# EasyEDA schematic circuit.json
TITLE: IH Temp Monitor; REV: 1.0; Date: 2018-09-06; Sheet: 1/1; Drawn By: Adrian Ritchie
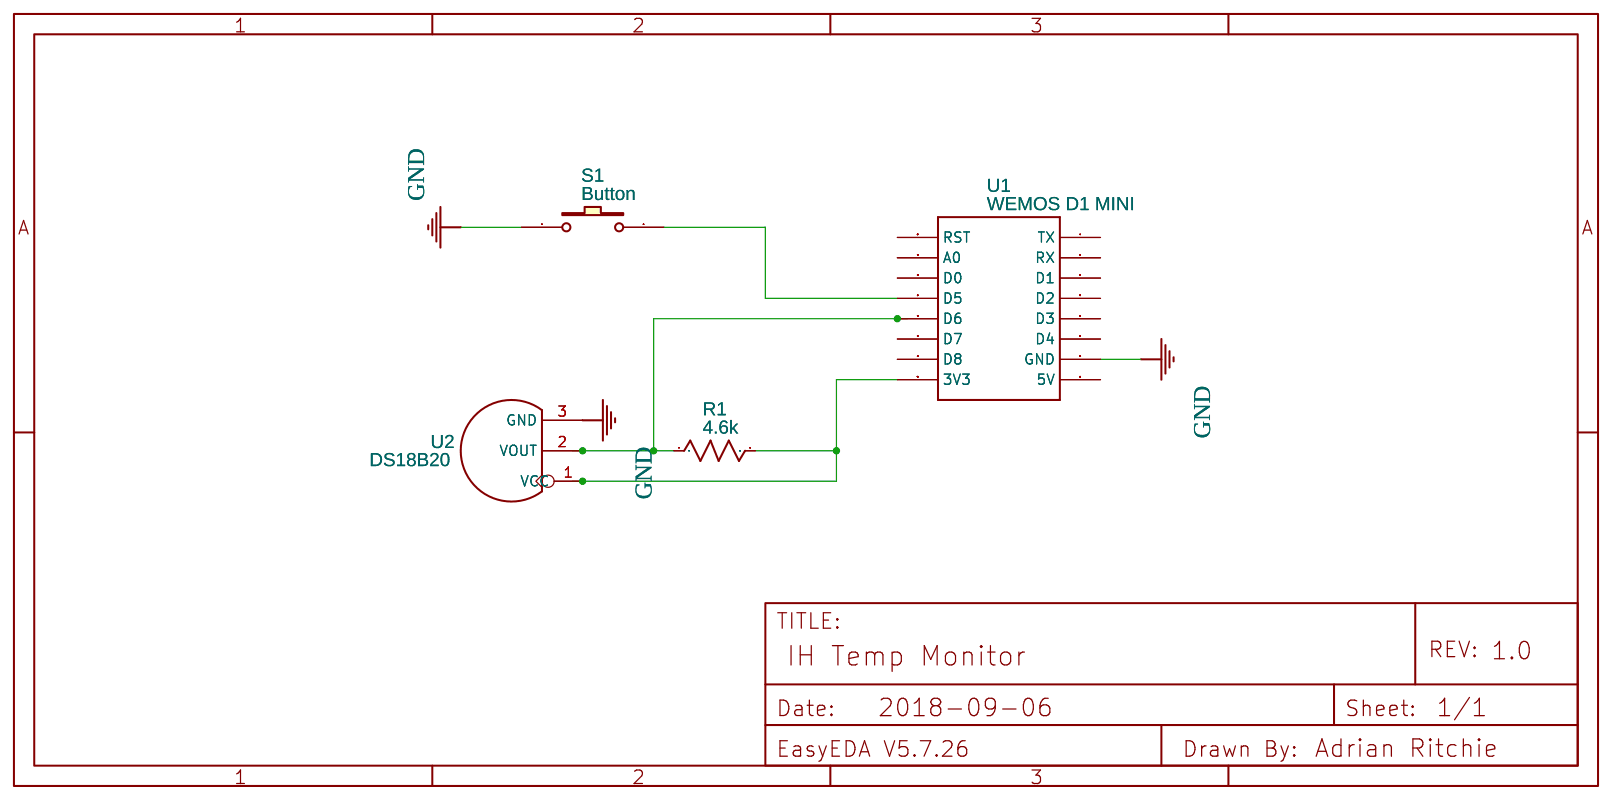
[diagram p0: schematic sheet]

## Parts
R1  4.6k  [AXIAL-0.3]
S1  Button  [PUSH BUTTON 6MM]
U1  WEMOS D1 MINI  [MY WEMOS D1 MINI V2]
U2  DS18B20  [TO-92 AMMO]

## Library data of the parts
R1 = Res_AXIAL-0.3(1/8W)_US: Manufacturer Part: ?
S1 = -: sourceId: K60iAuM3l; Manufacturer Part: ?
U1 = -: sourceId: YemgaslDx; Manufacturer Part: ?
U2 = -: Dallas 1-wire Temp Sensor; Supplier Part: 314010014; Supplier: SeeedStudio

## Nets
GND: S1.1 U1.GND U2.3(GND)
Net-(R1-1): R1.1 U1.D6 U2.2(VOUT)
Net-(R1-2): R1.2 U1.3V3 U2.1(VCC)
Net-(S1-2): S1.2 U1.D5

Not connected (* = marked no-connect by the designer): U1 5V A0 D0 D1 D2 D3 D4 D7 D8 RST RX TX
